# EAGLE schematic deneyap_board_erkek_pcb (EAGLE 9.6.2)
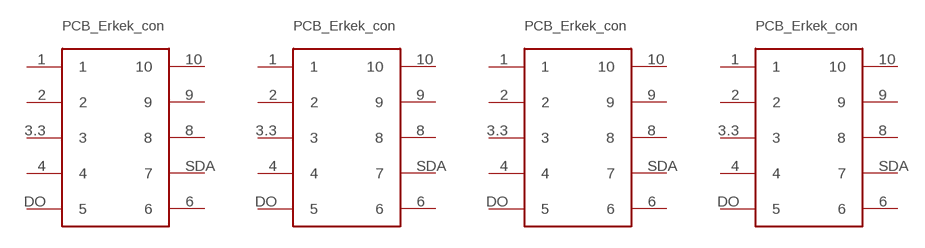
[diagram p0: schematic, sheet 1]

## Parts
U$1  PCB_ERKEK_CONNECTORA  [PCB_ERKEK_CONNECTOR]
U$2  PCB_ERKEK_CONNECTORA  [PCB_ERKEK_CONNECTOR]
U$3  PCB_ERKEK_CONNECTORA  [PCB_ERKEK_CONNECTOR]
U$4  PCB_ERKEK_CONNECTORA  [PCB_ERKEK_CONNECTOR]
Unconnected: U$1.1 U$1.2 U$1.3.3 U$1.4 U$1.6 U$1.8 U$1.9 U$1.10 U$1.DO U$1.SDA U$2.1 U$2.2 U$2.3.3 U$2.4 U$2.6 U$2.8 U$2.9 U$2.10 U$2.DO U$2.SDA U$3.1 U$3.2 U$3.3.3 U$3.4 U$3.6 U$3.8 U$3.9 U$3.10 U$3.DO U$3.SDA U$4.1 U$4.2 U$4.3.3 U$4.4 U$4.6 U$4.8 U$4.9 U$4.10 U$4.DO U$4.SDA

## Library data of the parts
U$1-U$4 = deneyap_board_erkek_pcb_lib:PCB_ERKEK_CONNECTOR